# Altium project vertical_daughter.PrjPcb
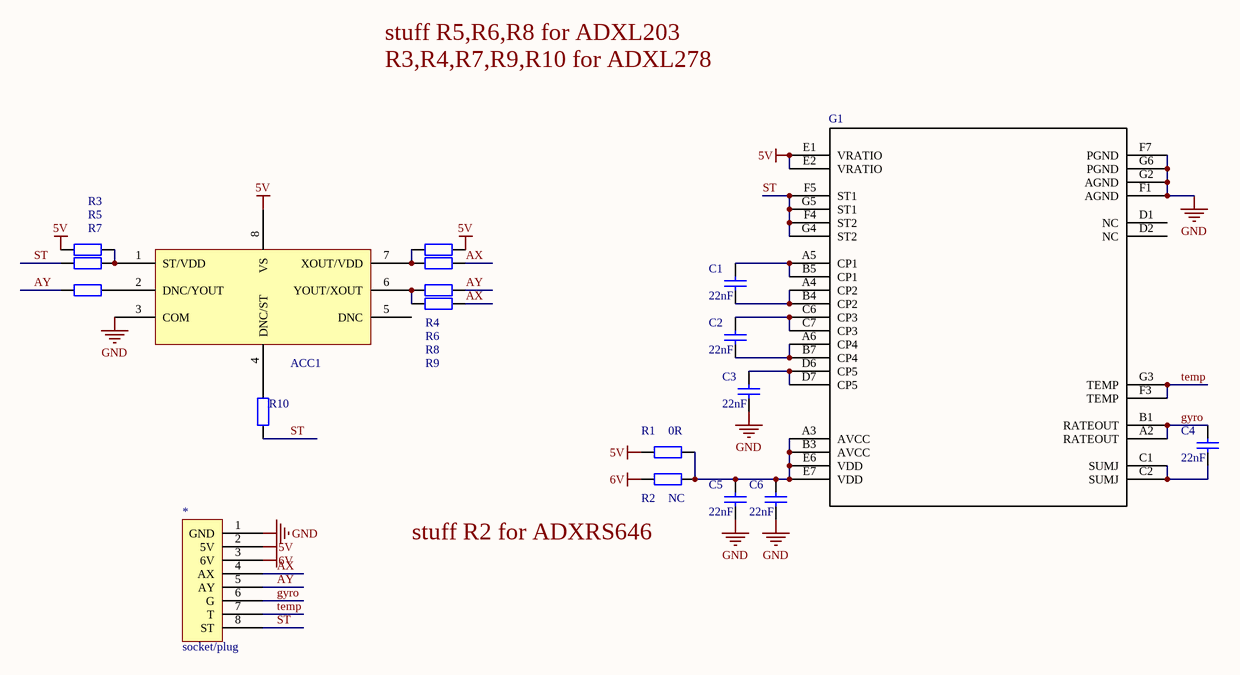
[diagram p0: IMU_VERTICAL.SchDoc]
1 sheet, 19 parts. Net scope: global (net labels, ports and power ports of the same name join across sheets).
Board file: vertical.PcbDoc

## Sheet IMU_VERTICAL.SchDoc
size A4

### Parts
*  socket/plug  [plug]
ACC1  ACC-8  [ADXL203]  (value not drawn)
C1  value 22nF  [0402]  (hidden comment: Cap)
C2  value 22nF  [0402]  (hidden comment: Cap)
C3  value 22nF  [0402]  (hidden comment: Cap)
C4  value 22nF  [0402]  (hidden comment: Cap)
C5  value 22nF  [0402]  (hidden comment: Cap)
C6  value 22nF  [0402]  (hidden comment: Cap)
G1  ADXRS620BBGZ  [BG_32_3]  (value not drawn)
R1  value 0R  [0402]
R2  value NC  [0402]
R3  (no value)  [0402]
R4  (no value)  [0402]
R5  (no value)  [0402]
R6  (no value)  [0402]
R7  (no value)  [0402]
R8  (no value)  [0402]
R9  (no value)  [0402]
R10  (no value)  [0402]

### Nets
5V: *.2(5V) ACC1.8(VS) G1.E1(VRATIO) G1.E2(VRATIO) R1.1 R3.1 R4.2
6V: *.3(6V) R2.1
GND: *.1(GND) ACC1.3(COM) C3.1 C5.1 C6.1 G1.F1(AGND) G1.F7(PGND) G1.G2(AGND) G1.G6(PGND)
AX: *.4(AX) R6.2 R9.2
AY: *.5(AY) R7.1 R8.2
gyro: *.6(G) C4.2 G1.A2(RATEOUT) G1.B1(RATEOUT)
ST: *.8(ST) G1.F4(ST2) G1.F5(ST1) G1.G4(ST2) G1.G5(ST1) R5.1 R10.1
temp: *.7(T) G1.F3(TEMP) G1.G3(TEMP)
NetACC1_1: ACC1.1(ST/VDD) R3.2 R5.2
NetACC1_2: ACC1.2(DNC/YOUT) R7.2
NetACC1_4: ACC1.4(DNC/ST) R10.2
NetACC1_6: ACC1.6(YOUT/XOUT) R8.1 R9.1
NetACC1_7: ACC1.7(XOUT/VDD) R4.1 R6.1
NetC1_1: C1.1 G1.A4(CP2) G1.B4(CP2)
NetC1_2: C1.2 G1.A5(CP1) G1.B5(CP1)
NetC2_1: C2.1 G1.A6(CP4) G1.B7(CP4)
NetC2_2: C2.2 G1.C6(CP3) G1.C7(CP3)
NetC3_2: C3.2 G1.D6(CP5) G1.D7(CP5)
NetC4_1: C4.1 G1.C1(SUMJ) G1.C2(SUMJ)
NetC5_2: C5.2 C6.2 G1.A3(AVCC) G1.B3(AVCC) G1.E6(VDD) G1.E7(VDD) R1.2 R2.2

Not connected (* = marked no-connect by the designer): ACC1 5(DNC); G1 D1(NC) D2(NC)

### Notes on the sheet
- stuff R5,R6,R8 for ADXL203
- R3,R4,R7,R9,R10 for ADXL278
- (near R2) stuff R2 for ADXRS646

### Library data of the parts
ACC1 = ACC-8: Imported; RefDes: RefDes; Type: DEV; Value: Value
C1-C6 = Cap: Capacitor; Published: 8-Jun-2000; LatestRevisionDate: 17-Jul-2002; LatestRevisionNote: Re-released for DXP Platform.; PackageReference: RAD-0.3; Publisher: Altium Limited; PackageDescription: Radial Cap, Thru-Hole; 2 Leads; 0.3 in Pin Spacing
G1 = ADXRS620BBGZ: Imported; Manufacturer_Part_Number: ADXRS613BBGZ; Vendor: Vendor; RefDes: RefDes; Type: DEV; Value: Value
R1 R2 = Res2: Resistor; Published: 8-Jun-2000; LatestRevisionDate: 17-Jul-2002; LatestRevisionNote: Re-released for DXP Platform.; PackageReference: AXIAL-0.4; Publisher: Altium Limited; PackageDescription: Axial Device, Thru-Hole; 2 Leads; 0.4 in Pin Spacing
R3-R10 = Res2: Resistor; Value: 0R; Published: 8-Jun-2000; LatestRevisionDate: 17-Jul-2002; LatestRevisionNote: Re-released for DXP Platform.; PackageReference: AXIAL-0.4; Publisher: Altium Limited; PackageDescription: Axial Device, Thru-Hole; 2 Leads; 0.4 in Pin Spacing